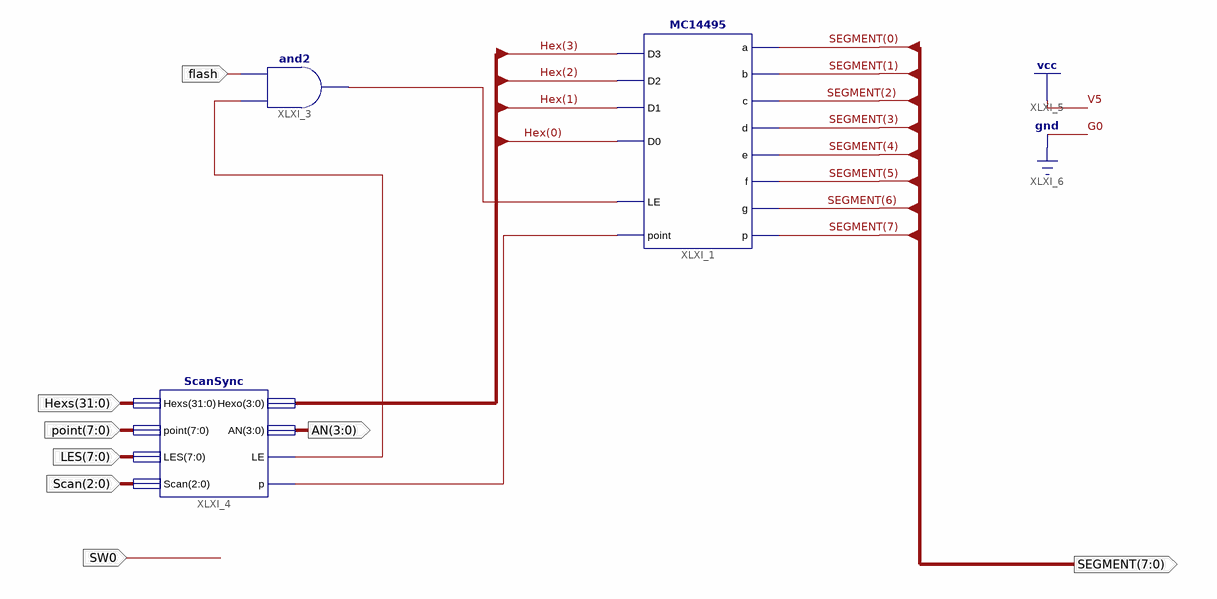
[diagram p0: schematic sheet 1]
// Xilinx ISE schematic Seg7_Dev.sch (kintex7) as structural Verilog: 3 symbols, 8 ports
module Seg7_Dev (
  input  flash,
  input  [7:0] point,
  input  [31:0] Hexs,
  input  [7:0] LES,
  input  [2:0] Scan,
  input  SW0,
  output [3:0] AN,
  output [7:0] SEGMENT
);

  wire XLXN_6, XLXN_7, XLXN_8;
  wire [3:0] Hex;

  MC14495 XLXI_1 (
    .D2(Hex[2]), .a(SEGMENT[0]), .b(SEGMENT[1]), .c(SEGMENT[2]), .d(SEGMENT[3]), .e(SEGMENT[4]),
    .f(SEGMENT[5]), .g(SEGMENT[6]), .p(SEGMENT[7]), .D3(Hex[3]), .D0(Hex[0]), .D1(Hex[1]), .LE(XLXN_6),
    .point(XLXN_7));
  and XLXI_3 (XLXN_6, XLXN_8, flash);
  ScanSync XLXI_4 (.Hexs(Hexs), .point(point), .LES(LES), .Scan(Scan), .Hexo(Hex), .AN(AN), .LE(XLXN_8), .p(XLXN_7));
endmodule
